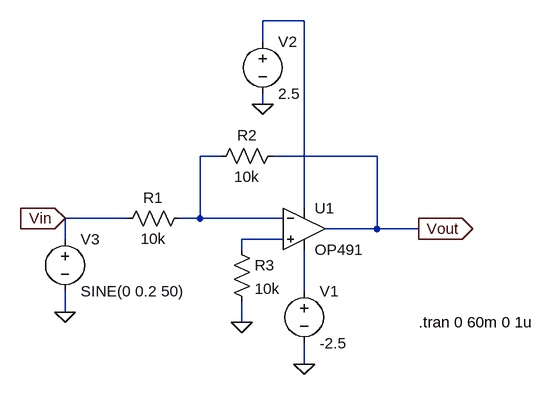
[diagram p0: schematic 001-inverting-amplifier.asc]
001-inverting-amplifier.asc, the LTspice schematic file:
Version 4
SHEET 1 880 680
WIRE 176 -208 112 -208
WIRE 112 -176 112 -208
WIRE 112 -80 112 -96
WIRE 48 0 16 0
WIRE 288 0 128 0
WIRE 176 80 176 -208
WIRE -96 96 -192 96
WIRE 16 96 16 0
WIRE 16 96 -16 96
WIRE 144 96 16 96
WIRE 288 112 288 0
WIRE 288 112 208 112
WIRE 352 112 288 112
WIRE -192 128 -192 96
WIRE 144 128 80 128
WIRE 80 144 80 128
WIRE 176 208 176 144
WIRE -192 240 -192 208
WIRE 80 256 80 224
WIRE 176 320 176 288
FLAG 80 256 0
FLAG 176 320 0
FLAG 112 -80 0
FLAG -192 240 0
FLAG -192 96 Vin
IOPIN -192 96 In
FLAG 352 112 Vout
IOPIN 352 112 Out
SYMBOL Opamps\\OP491 176 48 R0
SYMATTR InstName U1
SYMBOL res 64 128 R0
SYMATTR InstName R3
SYMATTR Value 10k
SYMBOL voltage 176 192 R0
SYMATTR InstName V1
SYMATTR Value -2.5
SYMBOL voltage 112 -192 R0
SYMATTR InstName V2
SYMATTR Value 2.5
SYMBOL res 0 80 R90
WINDOW 0 0 56 VBottom 2
WINDOW 3 32 56 VTop 2
SYMATTR InstName R1
SYMATTR Value 10k
SYMBOL res 144 -16 R90
WINDOW 0 0 56 VBottom 2
WINDOW 3 32 56 VTop 2
SYMATTR InstName R2
SYMATTR Value 10k
SYMBOL voltage -192 112 R0
WINDOW 123 0 0 Left 2
WINDOW 39 0 0 Left 2
SYMATTR InstName V3
SYMATTR Value SINE(0 0.2 50)
TEXT 352 256 Left 2 !.tran 0 60m 0 1u

The netlist it stands for:
* 001-inverting-amplifier.asc
XU1 N003 N002 N001 N004 Vout OP491  ; pins In+ In- V+ V- OUT
R3 N003 0 10k
V1 N004 0 -2.5
V2 N001 0 2.5
R1 N002 Vin 10k
R2 Vout N002 10k
V3 Vin 0 SINE(0 0.2 50)
.tran 0 60m 0 1u
.backanno
.end